# Altium project PCB_Project.PrjPcb
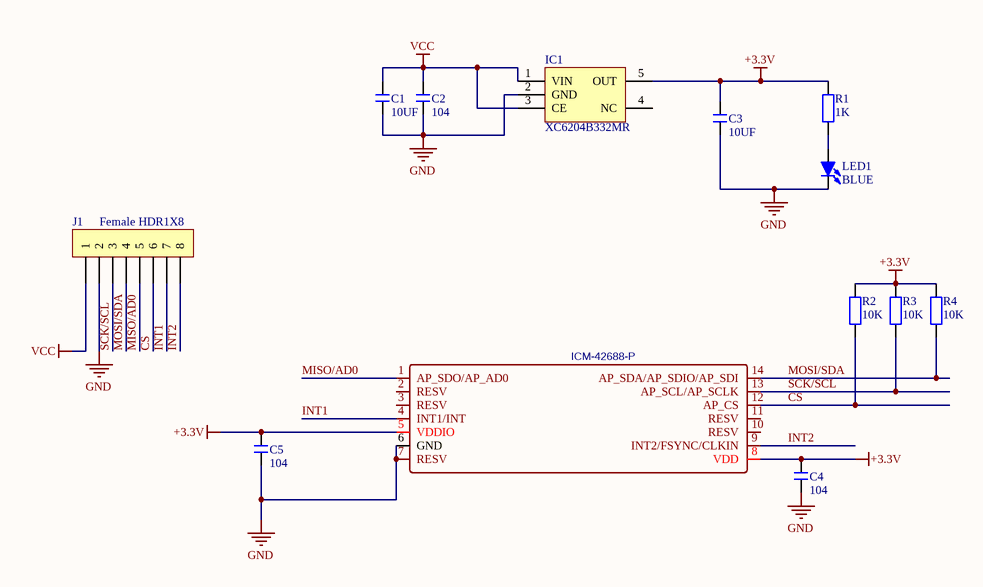
[diagram p0: Sheet1.SchDoc]
1 sheet, 13 parts. Net scope: global (net labels, ports and power ports of the same name join across sheets).
Board file: PCB1.PcbDoc

## Sheet Sheet1.SchDoc
size A3

### Parts
C1  10UF  [C 0603]
C2  104  [C 0603]
C3  10UF  [C 0603]
C4  104  [C 0603]
C5  104  [C 0603]
IC1  XC6204B332MR  [SOT23-5M]
IC2  ICM-42688-P  [LGA-14_L3.0-W2.5-P0.50-TL]
J1  Female HDR1X8  [Pin HDR1X8/2.54mm-S]
LED1  BLUE  [LED 0603R]
R1  1K  [0603R]
R2  10K  [0603R]
R3  10K  [0603R]
R4  10K  [0603R]

### Nets
+3.3V: C3.2 C4.2 C5.2 IC1.5(OUT) IC2.5(VDDIO) IC2.8(VDD) R1.2 R2.2 R3.2 R4.2
GND: C1.1 C2.1 C3.1 C4.1 C5.1 IC1.2(GND) IC2.6(GND) IC2.7(RESV) J1.2 LED1.2(K)
VCC: C1.2 C2.2 IC1.1(VIN) IC1.3(CE) J1.1
CS: IC2.12(AP_CS) J1.6 R2.1
INT1: IC2.4(INT1/INT) J1.7
INT2: IC2.9(INT2/FSYNC/CLKIN) J1.8
MISO/AD0: IC2.1(AP_SDO/AP_AD0) J1.5
MOSI/SDA: IC2.14(AP_SDA/AP_SDIO/AP_SDI) J1.4 R4.1
SCK/SCL: IC2.13(AP_SCL/AP_SCLK) J1.3 R3.1
NetLED1_1: LED1.1(A) R1.1

Not connected (* = marked no-connect by the designer): IC1 4(NC); IC2 2(RESV) 3(RESV) 10(RESV) 11(RESV)

### Library data of the parts
C1-C5 = C: 无极性贴片电容; 版权归属: 源创客; BOM名称: 无极性贴片电容; 学习资源: www.ooocke.com
IC1 = LDO XC6204: LDO; BOM名称: 稳压芯片; 版权归属: 源创客; 学习资源: www.ooocke.com
IC2 = ICM-42688-P: BOM_Manufacturer: InvenSense; Contributor: LCSC; BOM_Supplier: LCSC; BOM_Supplier Part: C1850418; BOM_Manufacturer Part: ICM-42688-P; BOM_JLCPCB Part Class: Extended Part; spicePre: R; spiceSymbolName: ICM-42688-P
LED1 = LED-SMD: 贴片LED; 版权归属: 源创客; BOM名称: 贴片LED; 学习资源: www.ooocke.com
R1-R4 = R: 贴片电阻; 版权归属: 源创客; BOM名称: 贴片电阻; 学习资源: www.ooocke.com